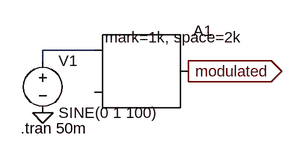
[diagram p0: schematic FM MODULATOR.asc]
FM MODULATOR.asc, the LTspice schematic file:
Version 4
SHEET 1 880 680
WIRE 160 112 80 112
WIRE 80 128 80 112
FLAG 304 144 modulated
IOPIN 304 144 Out
FLAG 80 208 0
SYMBOL SpecialFunctions\\modulate 160 112 R0
WINDOW 3 16 -20 Left 2
SYMATTR InstName A1
SYMATTR Value mark=1k, space=2k
SYMBOL voltage 80 112 R0
WINDOW 123 0 0 Left 0
WINDOW 39 0 0 Left 0
SYMATTR InstName V1
SYMATTR Value SINE(0 1 100)
TEXT 46 232 Left 2 !.tran 50m

The netlist it stands for:
* FM MODULATOR.asc
A1 N001 0 0 0 0 0 modulated 0 MODULATOR mark=1k, space=2k
V1 N001 0 SINE(0 1 100)
.tran 50m
.backanno
.end